# Altium schematic sheet USBHUB.SchDoc
size A3
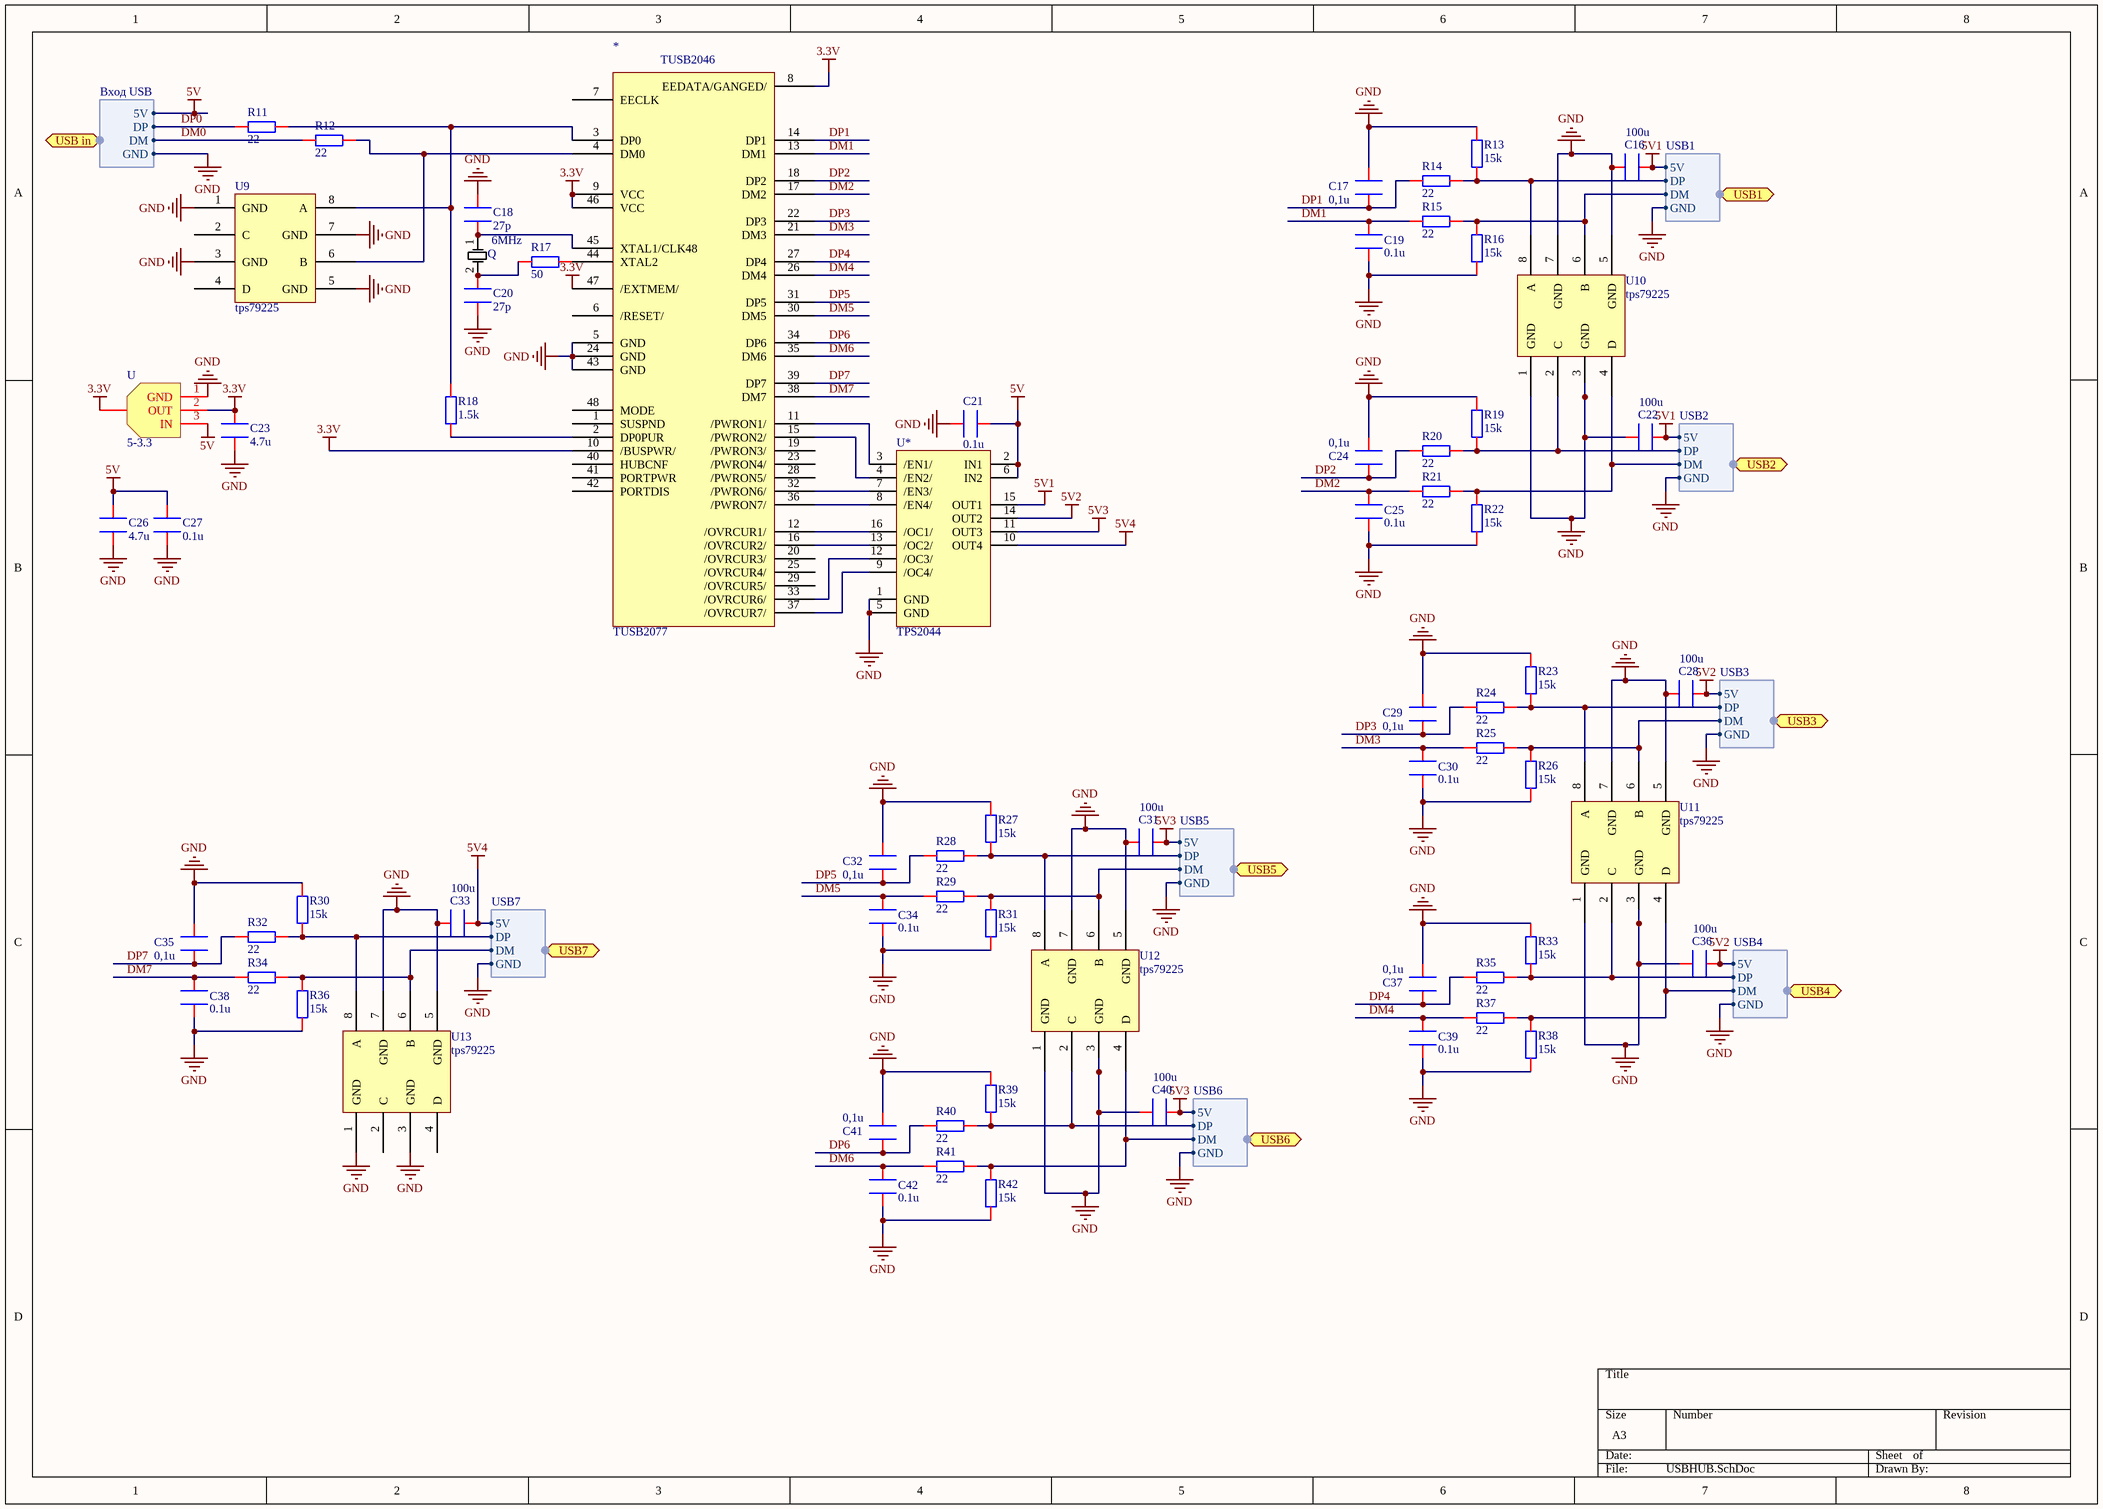
[diagram p0: USBHUB.SchDoc]

## Parts
*  TUSB2077
C16  100u  [SMD0603]
C17  0,1u  [SMD0603]
C18  27p  [SMD0603]
C19  0.1u  [SMD0603]
C20  27p  [SMD0603]
C21  0.1u  [SMD0603]
C22  100u  [SMD0603]
C23  4.7u  [SMD0603]
C24  0,1u  [SMD0603]
C25  0.1u  [SMD0603]
C26  4.7u  [SMD0603]
C27  0.1u  [SMD0603]
C28  100u  [SMD0603]
C29  0,1u  [SMD0603]
C30  0.1u  [SMD0603]
C31  100u  [SMD0603]
C32  0,1u  [SMD0603]
C33  100u  [SMD0603]
C34  0.1u  [SMD0603]
C35  0,1u  [SMD0603]
C36  100u  [SMD0603]
C37  0,1u  [SMD0603]
C38  0.1u  [SMD0603]
C39  0.1u  [SMD0603]
C40  100u  [SMD0603]
C41  0,1u  [SMD0603]
C42  0.1u  [SMD0603]
Q  6MHz
R11  22  [SMD0805]
R12  22  [SMD0805]
R13  15k  [SMD0805]
R14  22  [SMD0805]
R15  22  [SMD0805]
R16  15k  [SMD0805]
R17  50  [SMD0805]
R18  1.5k  [SMD0805]
R19  15k  [SMD0805]
R20  22  [SMD0805]
R21  22  [SMD0805]
R22  15k  [SMD0805]
R23  15k  [SMD0805]
R24  22  [SMD0805]
R25  22  [SMD0805]
R26  15k  [SMD0805]
R27  15k  [SMD0805]
R28  22  [SMD0805]
R29  22  [SMD0805]
R30  15k  [SMD0805]
R31  15k  [SMD0805]
R32  22  [SMD0805]
R33  15k  [SMD0805]
R34  22  [SMD0805]
R35  22  [SMD0805]
R36  15k  [SMD0805]
R37  22  [SMD0805]
R38  15k  [SMD0805]
R39  15k  [SMD0805]
R40  22  [SMD0805]
R41  22  [SMD0805]
R42  15k  [SMD0805]
U  5-3.3
U9  tps79225  [SOT-23-5]
U10  tps79225  [SOT-23-5]
U11  tps79225  [SOT-23-5]
U12  tps79225  [SOT-23-5]
U13  tps79225  [SOT-23-5]
U*  TPS2044  [VSSOP-8]

## Ports
USB1 (harness USB1), USB2 (harness USB2), USB3 (harness USB3), USB4 (harness USB4), USB5 (harness USB5), USB6 (harness USB6), USB7 (harness USB7), USB in (harness Вход USB)

## Harnesses
Вход USB: 5V, DP, DM, GND
USB1: 5V, DP, DM, GND
USB2: 5V, DP, DM, GND
USB3: 5V, DP, DM, GND
USB4: 5V, DP, DM, GND
USB5: 5V, DP, DM, GND
USB6: 5V, DP, DM, GND
USB7: 5V, DP, DM, GND

## Nets
3.3V: *.8(EEDATA/GANGED/) *.9(VCC) *.10(/BUSPWR/) *.46(VCC) *.47(/EXTMEM/) C23.1 U.2(OUT) U.3(OUT)
5V: C21.1 C26.1 C27.1 U.3(IN) U*.2(IN1) U*.6(IN2) ; port USB in.5V
5V1: C16.1 C22.1 U*.15(OUT1) ; port USB1.5V, port USB2.5V
5V2: C28.1 C36.1 U*.14(OUT2) ; port USB3.5V, port USB4.5V
5V3: C31.1 C40.1 U*.11(OUT3) ; port USB5.5V, port USB6.5V
5V4: C33.1 U*.10(OUT4) ; port USB7.5V
GND: *.5(GND) *.24(GND) *.43(GND) C16.2 C17.2 C18.1 C19.2 C20.2 C21.2 C22.2 C23.2 C24.2 C25.2 C26.2 C27.2 C28.2 C29.2 C30.2 C31.2 C32.2 C33.2 C34.2 C35.2 C36.2 C37.2 C38.2 C39.2 C40.2 C41.2 C42.2 R13.2 R16.1 R19.2 R22.1 R23.2 R26.1 R27.2 R30.2 R31.1 R33.2 R36.1 R38.1 R39.2 R42.1 U.1(GND) U9.1(GND) U9.3(GND) U9.5(GND) U9.7(GND) U10.1(GND) U10.3(GND) U10.5(GND) U10.7(GND) U11.1(GND) U11.3(GND) U11.5(GND) U11.7(GND) U12.1(GND) U12.3(GND) U12.5(GND) U12.7(GND) U13.1(GND) U13.3(GND) U13.5(GND) U13.7(GND) U*.1(GND) U*.5(GND) ; port USB in.GND, port USB1.GND, port USB2.GND, port USB3.GND, port USB4.GND, port USB5.GND, port USB6.GND, port USB7.GND
DM0: R12.1 ; port USB in.DM
DM1: *.13(DM1) C19.1 R15.1
DM2: *.17(DM2) C25.1 R21.1
DM3: *.21(DM3) C30.1 R25.1
DM4: *.26(DM4) C39.1 R37.1
DM5: *.30(DM5) C34.1 R29.1
DM6: *.35(DM6) C42.1 R41.1
DM7: *.38(DM7) C38.1 R34.1
DP0: R11.1 ; port USB in.DP
DP1: *.14(DP1) C17.1 R14.1
DP2: *.18(DP2) C24.1 R20.1
DP3: *.22(DP3) C29.1 R24.1
DP4: *.27(DP4) C37.1 R35.1
DP5: *.31(DP5) C32.1 R28.1
DP6: *.34(DP6) C41.1 R40.1
DP7: *.39(DP7) C35.1 R32.1
Net*_2: *.2(DP0PUR) R18.1
Net*_3: *.3(DP0) R11.2 R18.2 U9.8(A)
Net*_4: *.4(DM0) R12.2 U9.6(B)
Net*_11: *.11(/PWRON1/) U*.3(/EN1/)
Net*_12: *.12(/OVRCUR1/) U*.16(/OC1/)
Net*_15: *.15(/PWRON2/) U*.4(/EN2/)
Net*_16: *.16(/OVRCUR2/) U*.13(/OC2/)
Net*_32: *.32(/PWRON6/) U*.7(/EN3/)
Net*_33: *.33(/OVRCUR6/) U*.12(/OC3/)
Net*_36: *.36(/PWRON7/) U*.8(/EN4/)
Net*_37: *.37(/OVRCUR7/) U*.9(/OC4/)
Net*_44: *.44(XTAL2) R17.2
Net*_45: *.45(XTAL1/CLK48) C18.2 Q.1
NetC20_1: C20.1 Q.2 R17.1
NetR13_1: R13.1 R14.2 U10.8(A) ; port USB1.DP
NetR15_2: R15.2 R16.2 U10.6(B) ; port USB1.DM
NetR19_1: R19.1 R20.2 U10.2(C) ; port USB2.DP
NetR21_2: R21.2 R22.2 U10.4(D) ; port USB2.DM
NetR23_1: R23.1 R24.2 U11.8(A) ; port USB3.DP
NetR25_2: R25.2 R26.2 U11.6(B) ; port USB3.DM
NetR27_1: R27.1 R28.2 U12.8(A) ; port USB5.DP
NetR29_2: R29.2 R31.2 U12.6(B) ; port USB5.DM
NetR30_1: R30.1 R32.2 U13.8(A) ; port USB7.DP
NetR33_1: R33.1 R35.2 U11.2(C) ; port USB4.DP
NetR34_2: R34.2 R36.2 U13.6(B) ; port USB7.DM
NetR37_2: R37.2 R38.2 U11.4(D) ; port USB4.DM
NetR39_1: R39.1 R40.2 U12.2(C) ; port USB6.DP
NetR41_2: R41.2 R42.2 U12.4(D) ; port USB6.DM

Not connected (* = marked no-connect by the designer): * 1(SUSPND) 6(/RESET/) 7(EECLK) 19(/PWRON3/) 20(/OVRCUR3/) 23(/PWRON4/) 25(/OVRCUR4/) 28(/PWRON5/) 29(/OVRCUR5/) 40(HUBCNF) 41(PORTPWR) 42(PORTDIS) 48(MODE); U9 2(C) 4(D); U13 2(C) 4(D)

## Notes on the sheet
- (in symbol TUSB2077) TUSB2046

## Library data of the parts
C16-C42 = CAP: value: *
Q = Quartz
R11-R42 = RES_SMD: value: 0
U = TLV1117LV
U9-U13 = SN75240: value: tps79225